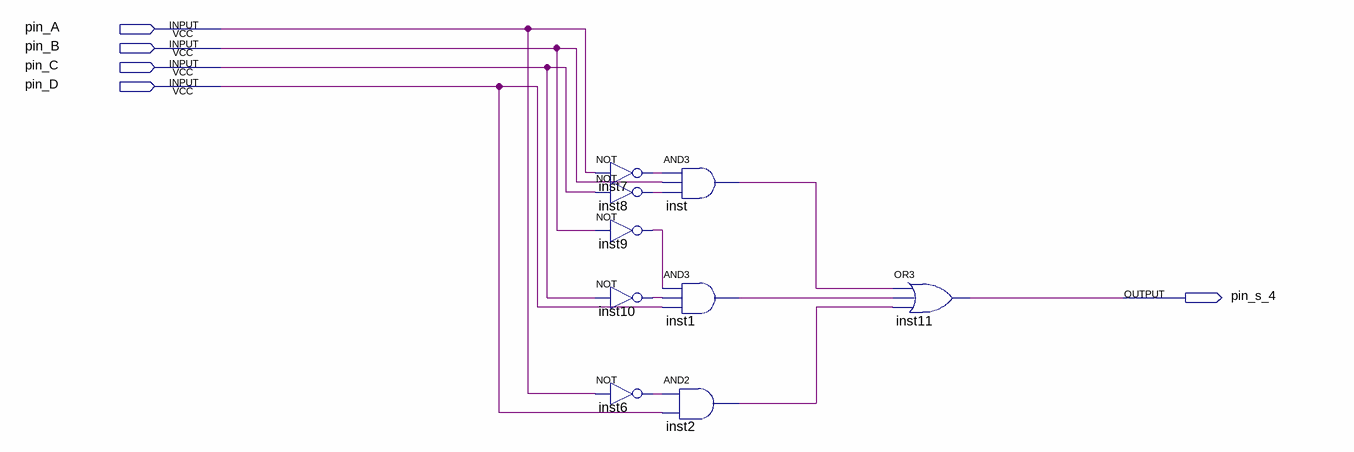
[diagram p0: schematic sheet]
// Quartus schematic s_4.bdf as structural Verilog: 9 symbols, 5 pins
module s_4 (
  input  pin_A,
  input  pin_B,
  input  pin_C,
  input  pin_D,
  output pin_s_4
);

  wire inst1_out, inst2_out, inst6_out, inst7_out, inst8_out, inst9_out, inst10_out, inst_out;

  not inst7 (inst7_out, pin_A);
  not inst8 (inst8_out, pin_C);
  not inst9 (inst9_out, pin_B);
  not inst10 (inst10_out, pin_C);
  not inst6 (inst6_out, pin_A);
  and inst (inst_out, inst7_out, pin_B, inst8_out);
  and inst1 (inst1_out, inst9_out, inst10_out, pin_D);
  and inst2 (inst2_out, inst6_out, pin_D);
  or inst11 (pin_s_4, inst_out, inst1_out, inst2_out);
endmodule
